# Altium schematic sheet FPGA_Connector_2.SchDoc: BXZ7C01: FPGA Connector 2
size A3; CompanyName: GVI; Address2: 杭州言曼科技有限公司; Address3: www.gvi-tech.com; DocumentNumber: BXZ7C01; Revision: A; SheetNumber: 7; SheetTotal: 10
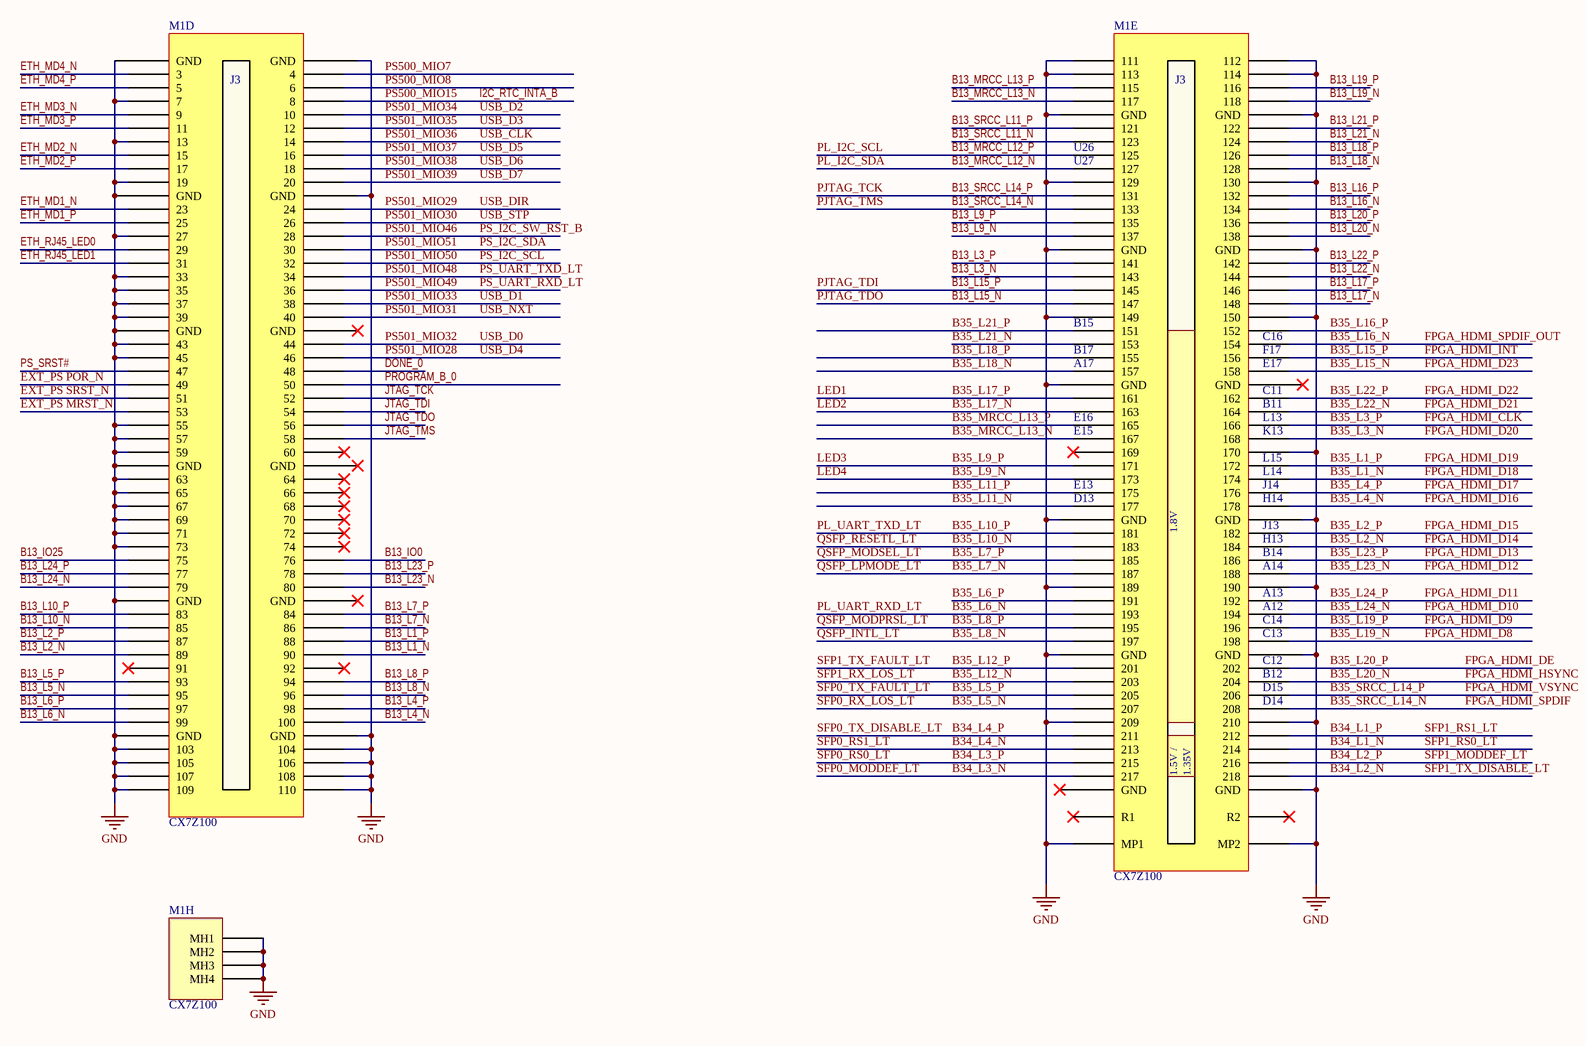
[diagram p0: FPGA_Connector_2.SchDoc]

## Parts
M1  CX7Z100  [GVI_Z7_MiniModule_Socket]  (parts D,E,H of 8)

## Blocks framed on the sheet
1.8V: M1

## Nets
GND: M1.MH1 M1.MH2 M1.MH3 M1.MH4 M1.T1(GND) M1.T2(GND) M1.T7(7) M1.T13(13) M1.T19(19) M1.T21(GND) M1.T22(GND) M1.T27(27) M1.T33(33) M1.T35(35) M1.T37(37) M1.T39(39) M1.T41(GND) M1.T43(43) M1.T45(45) M1.T55(55) M1.T57(57) M1.T59(59) M1.T61(GND) M1.T63(63) M1.T65(65) M1.T67(67) M1.T69(69) M1.T71(71) M1.T73(73) M1.T81(GND) M1.T101(GND) M1.T102(GND) M1.T103(103) M1.T104(104) M1.T105(105) M1.T106(106) M1.T107(107) M1.T108(108) M1.T109(109) M1.T110(110) M1.T111(111) M1.T112(112) M1.T113(113) M1.T114(114) M1.T119(GND) M1.T120(GND) M1.T129(129) M1.T130(130) M1.T139(GND) M1.T140(GND) M1.T149(149) M1.T150(150) M1.T159(GND) M1.T170(170) M1.T179(GND) M1.T180(GND) M1.T189(189) M1.T190(190) M1.T199(GND) M1.T200(GND) M1.T209(209) M1.T210(210) M1.T220(GND) M1.TMP1(MP1) M1.TMP2(MP2)
B13_IO0: M1.T76(76)
B13_IO25: M1.T75(75)
B13_L1_N: M1.T90(90)
B13_L1_P: M1.T88(88)
B13_L2_N: M1.T89(89)
B13_L2_P: M1.T87(87)
B13_L3_N: M1.T143(143)
B13_L3_P: M1.T141(141)
B13_L4_N: M1.T100(100)
B13_L4_P: M1.T98(98)
B13_L5_N: M1.T95(95)
B13_L5_P: M1.T93(93)
B13_L6_N: M1.T99(99)
B13_L6_P: M1.T97(97)
B13_L7_N: M1.T86(86)
B13_L7_P: M1.T84(84)
B13_L8_N: M1.T96(96)
B13_L8_P: M1.T94(94)
B13_L9_N: M1.T137(137)
B13_L9_P: M1.T135(135)
B13_L10_N: M1.T85(85)
B13_L10_P: M1.T83(83)
B13_L15_N: M1.T147(147)  [also labelled PJTAG_TDO]
B13_L15_P: M1.T145(145)  [also labelled PJTAG_TDI]
B13_L16_N: M1.T134(134)
B13_L16_P: M1.T132(132)
B13_L17_N: M1.T148(148)
B13_L17_P: M1.T146(146)
B13_L18_N: M1.T128(128)
B13_L18_P: M1.T126(126)
B13_L19_N: M1.T118(118)
B13_L19_P: M1.T116(116)
B13_L20_N: M1.T138(138)
B13_L20_P: M1.T136(136)
B13_L21_N: M1.T124(124)
B13_L21_P: M1.T122(122)
B13_L22_N: M1.T144(144)
B13_L22_P: M1.T142(142)
B13_L23_N: M1.T80(80)
B13_L23_P: M1.T78(78)
B13_L24_N: M1.T79(79)
B13_L24_P: M1.T77(77)
B13_MRCC_L12_N: M1.T127(127)  [also labelled PL_I2C_SDA]
B13_MRCC_L12_P: M1.T125(125)  [also labelled PL_I2C_SCL]
B13_MRCC_L13_N: M1.T117(117)
B13_MRCC_L13_P: M1.T115(115)
B13_SRCC_L11_N: M1.T123(123)
B13_SRCC_L11_P: M1.T121(121)
B13_SRCC_L14_N: M1.T133(133)  [also labelled PJTAG_TMS]
B13_SRCC_L14_P: M1.T131(131)  [also labelled PJTAG_TCK]
B34_L1_N: M1.T214(214)  [also labelled SFP1_RS0_LT]
B34_L1_P: M1.T212(212)  [also labelled SFP1_RS1_LT]
B34_L2_N: M1.T218(218)  [also labelled SFP1_TX_DISABLE_LT]
B34_L2_P: M1.T216(216)  [also labelled SFP1_MODDEF_LT]
B34_L3_N: M1.T217(217)  [also labelled SFP0_MODDEF_LT]
B34_L3_P: M1.T215(215)  [also labelled SFP0_RS0_LT]
B34_L4_N: M1.T213(213)  [also labelled SFP0_RS1_LT]
B34_L4_P: M1.T211(211)  [also labelled SFP0_TX_DISABLE_LT]
B35_L1_N: M1.T174(174)  [also labelled FPGA_HDMI_D18]
B35_L1_P: M1.T172(172)  [also labelled FPGA_HDMI_D19]
B35_L2_N: M1.T184(184)  [also labelled FPGA_HDMI_D14]
B35_L2_P: M1.T182(182)  [also labelled FPGA_HDMI_D15]
B35_L3_N: M1.T168(168)  [also labelled FPGA_HDMI_D20]
B35_L3_P: M1.T166(166)  [also labelled FPGA_HDMI_CLK]
B35_L4_N: M1.T178(178)  [also labelled FPGA_HDMI_D16]
B35_L4_P: M1.T176(176)  [also labelled FPGA_HDMI_D17]
B35_L5_N: M1.T207(207)  [also labelled SFP0_RX_LOS_LT]
B35_L5_P: M1.T205(205)  [also labelled SFP0_TX_FAULT_LT]
B35_L6_N: M1.T193(193)  [also labelled PL_UART_RXD_LT]
B35_L6_P: M1.T191(191)
B35_L7_N: M1.T187(187)  [also labelled QSFP_LPMODE_LT]
B35_L7_P: M1.T185(185)  [also labelled QSFP_MODSEL_LT]
B35_L8_N: M1.T197(197)  [also labelled QSFP_INTL_LT]
B35_L8_P: M1.T195(195)  [also labelled QSFP_MODPRSL_LT]
B35_L9_N: M1.T173(173)  [also labelled LED4]
B35_L9_P: M1.T171(171)  [also labelled LED3]
B35_L10_N: M1.T183(183)  [also labelled QSFP_RESETL_LT]
B35_L10_P: M1.T181(181)  [also labelled PL_UART_TXD_LT]
B35_L11_N: M1.T177(177)
B35_L11_P: M1.T175(175)
B35_L12_N: M1.T203(203)  [also labelled SFP1_RX_LOS_LT]
B35_L12_P: M1.T201(201)  [also labelled SFP1_TX_FAULT_LT]
B35_L15_N: M1.T158(158)  [also labelled FPGA_HDMI_D23]
B35_L15_P: M1.T156(156)  [also labelled FPGA_HDMI_INT]
B35_L16_N: M1.T154(154)  [also labelled FPGA_HDMI_SPDIF_OUT]
B35_L16_P: M1.T152(152)
B35_L17_N: M1.T163(163)  [also labelled LED2]
B35_L17_P: M1.T161(161)  [also labelled LED1]
B35_L18_N: M1.T157(157)
B35_L18_P: M1.T155(155)
B35_L19_N: M1.T198(198)  [also labelled FPGA_HDMI_D8]
B35_L19_P: M1.T196(196)  [also labelled FPGA_HDMI_D9]
B35_L20_N: M1.T204(204)  [also labelled FPGA_HDMI_HSYNC]
B35_L20_P: M1.T202(202)  [also labelled FPGA_HDMI_DE]
B35_L21_N: M1.T153(153)
B35_L21_P: M1.T151(151)
B35_L22_N: M1.T164(164)  [also labelled FPGA_HDMI_D21]
B35_L22_P: M1.T162(162)  [also labelled FPGA_HDMI_D22]
B35_L23_N: M1.T188(188)  [also labelled FPGA_HDMI_D12]
B35_L23_P: M1.T186(186)  [also labelled FPGA_HDMI_D13]
B35_L24_N: M1.T194(194)  [also labelled FPGA_HDMI_D10]
B35_L24_P: M1.T192(192)  [also labelled FPGA_HDMI_D11]
B35_MRCC_L13_N: M1.T167(167)
B35_MRCC_L13_P: M1.T165(165)
B35_SRCC_L14_N: M1.T208(208)  [also labelled FPGA_HDMI_SPDIF]
B35_SRCC_L14_P: M1.T206(206)  [also labelled FPGA_HDMI_VSYNC]
DONE_0: M1.T48(48)
ETH_MD1_N: M1.T23(23)
ETH_MD1_P: M1.T25(25)
ETH_MD2_N: M1.T15(15)
ETH_MD2_P: M1.T17(17)
ETH_MD3_N: M1.T9(9)
ETH_MD3_P: M1.T11(11)
ETH_MD4_N: M1.T3(3)
ETH_MD4_P: M1.T5(5)
ETH_RJ45_LED0: M1.T29(29)
ETH_RJ45_LED1: M1.T31(31)
EXT_PS MRST_N: M1.T53(53)
EXT_PS POR_N: M1.T49(49)
EXT_PS SRST_N: M1.T51(51)
I2C_RTC_INTA_B: M1.T8(8)  [also labelled PS500_MIO15]
JTAG_TCK: M1.T52(52)
JTAG_TDI: M1.T54(54)
JTAG_TDO: M1.T56(56)
JTAG_TMS: M1.T58(58)
PROGRAM_B_0: M1.T50(50)
PS500_MIO7: M1.T4(4)
PS500_MIO8: M1.T6(6)
PS501_MIO28: M1.T46(46)  [also labelled USB_D4]
PS501_MIO29: M1.T24(24)  [also labelled USB_DIR]
PS501_MIO30: M1.T26(26)  [also labelled USB_STP]
PS501_MIO31: M1.T40(40)  [also labelled USB_NXT]
PS501_MIO32: M1.T44(44)  [also labelled USB_D0]
PS501_MIO33: M1.T38(38)  [also labelled USB_D1]
PS501_MIO34: M1.T10(10)  [also labelled USB_D2]
PS501_MIO35: M1.T12(12)  [also labelled USB_D3]
PS501_MIO36: M1.T14(14)  [also labelled USB_CLK]
PS501_MIO37: M1.T16(16)  [also labelled USB_D5]
PS501_MIO38: M1.T18(18)  [also labelled USB_D6]
PS501_MIO39: M1.T20(20)  [also labelled USB_D7]
PS501_MIO46: M1.T28(28)  [also labelled PS_I2C_SW_RST_B]
PS501_MIO48: M1.T34(34)  [also labelled PS_UART_TXD_LT]
PS501_MIO49: M1.T36(36)  [also labelled PS_UART_RXD_LT]
PS501_MIO50: M1.T32(32)  [also labelled PS_I2C_SCL]
PS501_MIO51: M1.T30(30)  [also labelled PS_I2C_SDA]
PS_SRST#: M1.T47(47)

Not connected (* = marked no-connect by the designer): M1 T42(GND)* T60(60)* T62(GND)* T64(64)* T66(66)* T68(68)* T70(70)* T72(72)* T74(74)* T82(GND)* T91(91)* T92(92)* T160(GND)* T169(169)* T219(GND)* TR1(R1)* TR2(R2)*

## Notes on the sheet
- (near M1) U26
- (near M1) U27
- (near M1) B17
- (near M1) B15
- (near M1) F17
- (near M1) C16
- (near M1) E16
- (near M1) A17
- (near M1) L13
- (near M1) B11
- (near M1) C11
- (near M1) E17
- (near M1) E15
- (near M1) E13
- (near M1) J14
- (near M1) L14
- (near M1) L15
- (near M1) K13
- (near M1) D13
- (near M1) B14
- (near M1) H13
- (near M1) J13
- (near M1) H14
- (near M1) C14
- (near M1) A12
- (near M1) A13
- (near M1) A14
- (near M1) C13
- (near M1) C12
- (near M1) B12
- (near M1) D15
- (near M1) D14
- (near M1) 1.5V /
- (near M1) 1.35V
- Title
- Size:
- Date:
- A3
- Number:
- Time:
- Revision:
- Sheet
- of
- File:
- (in symbol CX7Z100, part D) J3
- (in symbol CX7Z100, part E) J3

## Library data of the parts
M1 = CX7Z100: Value: 1 x QTH-090-02-L-D-A, 2 x TE 3-6318491-6